# EAGLE design Conn_pcb3 (EAGLE 9.1.0)

## Sheet 1 of 2
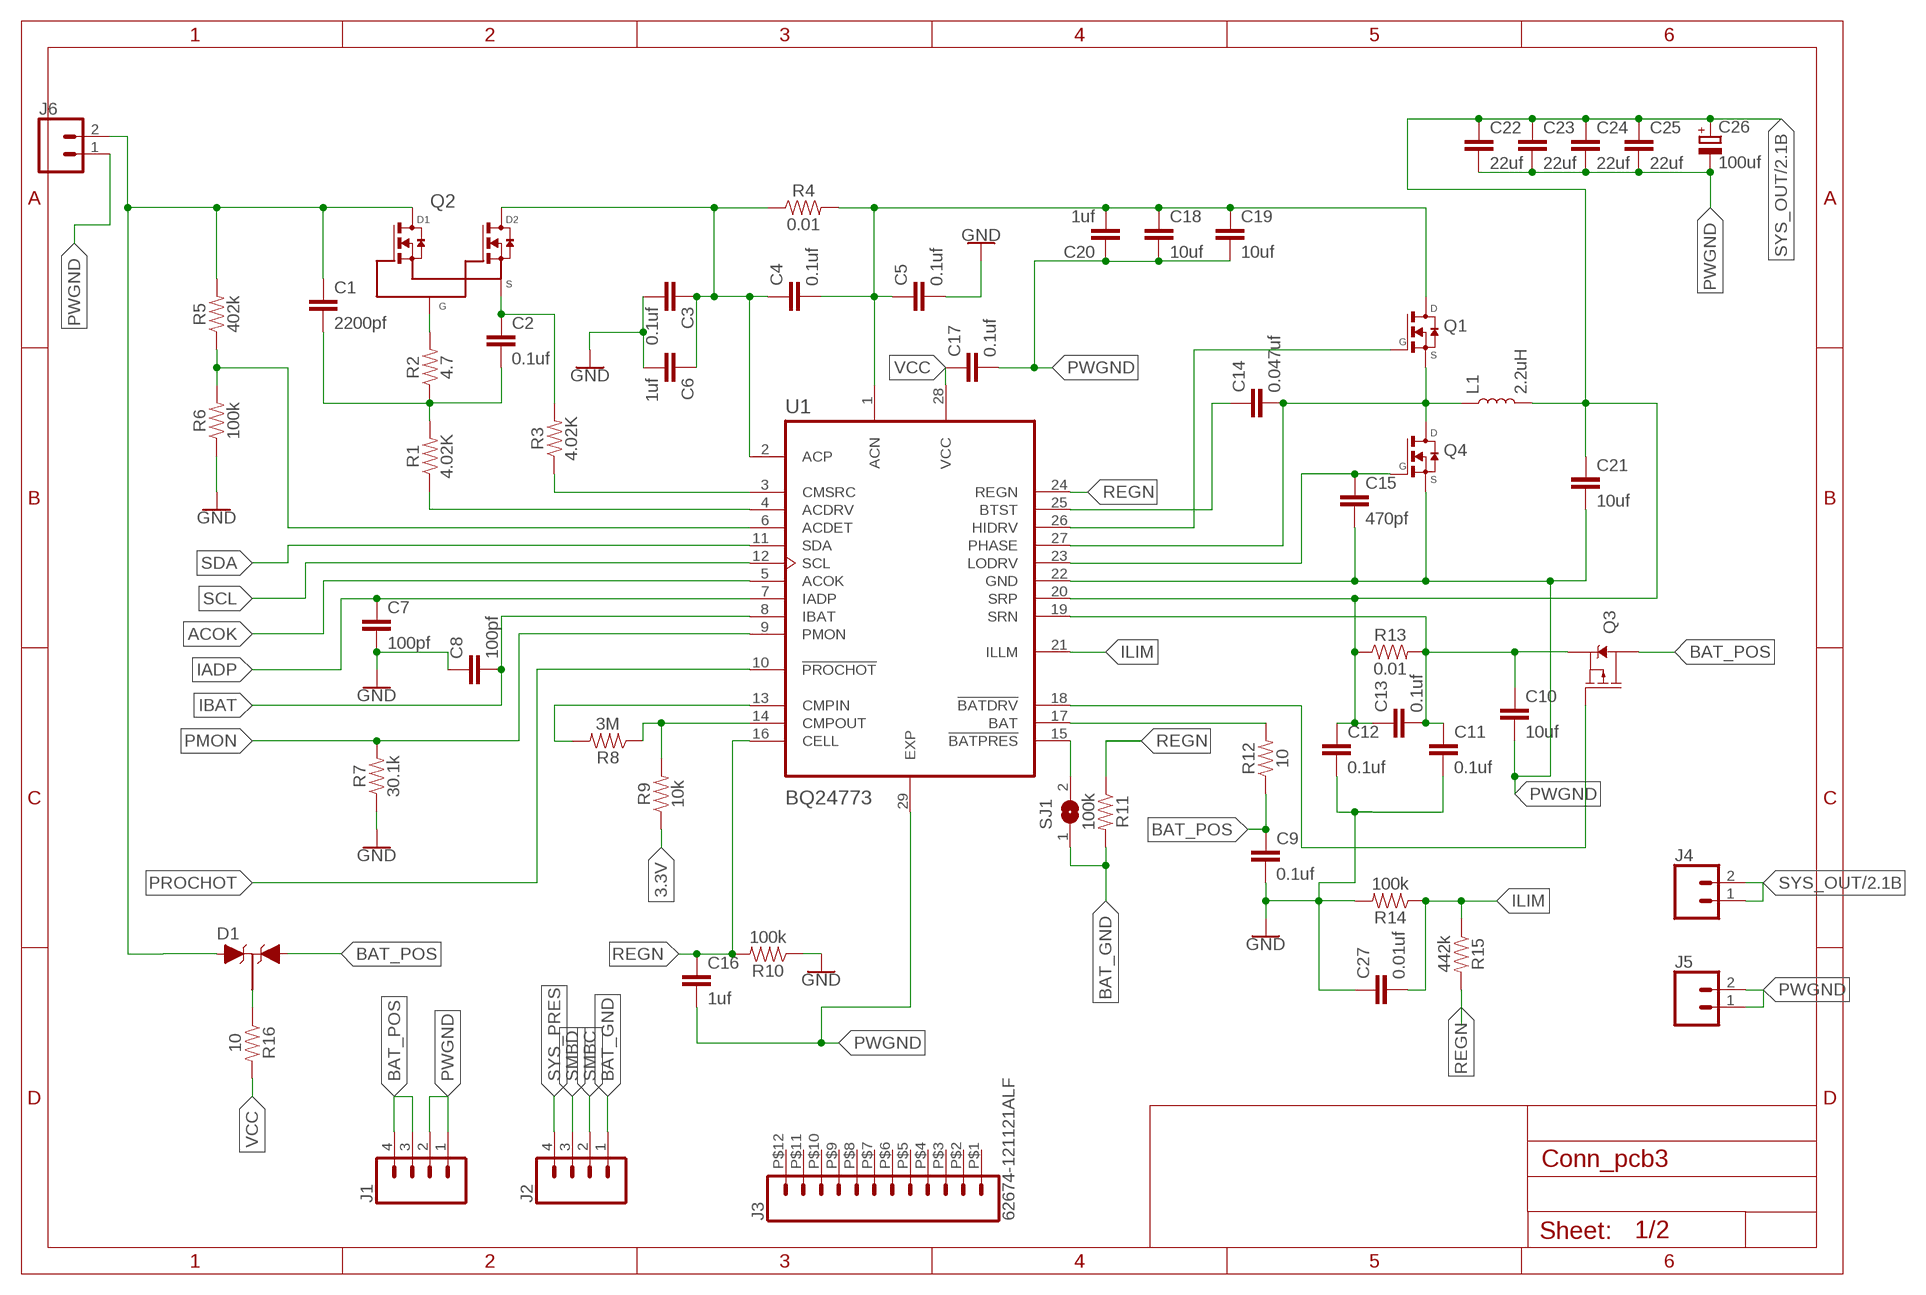
[diagram p0: schematic, sheet 1]

### Parts
C1  2200pf  CAP0402  [CAPC1005X50]
C2  0.1uf  CAP0402  [CAPC1005X50]
C3  0.1uf  CAP0402  [CAPC1005X50]
C4  0.1uf  CAP0402  [CAPC1005X50]
C5  0.1uf  CAP0402  [CAPC1005X50]
C6  1uf  CAP0402  [CAPC1005X50]
C7  100pf  CAP0402  [CAPC1005X50]
C8  100pf  CAP0402  [CAPC1005X50]
C9  0.1uf  CAP0402  [CAPC1005X50]
C10  10uf  C-EUC0805K  [C0805K]
C11  0.1uf  CAP0402  [CAPC1005X50]
C12  0.1uf  CAP0402  [CAPC1005X50]
C13  0.1uf  CAP0402  [CAPC1005X50]
C14  0.047uf  CAP0402  [CAPC1005X50]
C15  470pf  CAP0402  [CAPC1005X50]
C16  1uf  CAP0402  [CAPC1005X50]
C17  0.1uf  CAP0402  [CAPC1005X50]
C18  10uf  C-EUC0805K  [C0805K]
C19  10uf  C-EUC0805K  [C0805K]
C20  1uf  CAP0402  [CAPC1005X50]
C21  10uf  C-EUC0805K  [C0805K]
C22  22uf  C-EUC1206  [C1206]
C23  22uf  C-EUC1206  [C1206]
C24  22uf  C-EUC1206  [C1206]
C25  22uf  C-EUC1206  [C1206]
C26  100uf  16SVP100M  [CAPAE1030X800]
C27  0.01uf  CAP0402  [CAPC1005X50]
D1  BAT54C-7-F  [SOT95P235X110-3]
J1  CONN_041.3  [1X04_NO_SILK_1.3]
J2  CONN_041.3  [1X04_NO_SILK_1.3]
J3  62674-121121ALF  [62674-121121ALF]
J4  CONN_021.4HOLE  [1X02_1.4HOLE]
J5  CONN_021.4HOLE  [1X02_1.4HOLE]
J6  CONN_021.4HOLE  [1X02_1.4HOLE]
L1  2.2uH  XEL6060-222MEB  [RESM6365X610]
Q1  CSD17308Q3  [SON65P330X330X110-8]
Q2  CSD87312Q3EVSON  [QFN65P330X330X100-12]
Q3  CSD25402Q3A  [CSD25402Q3A]
Q4  CSD17308Q3  [SON65P330X330X110-8]
R1  4.02K  RES4K04020402  [0402]
R2  4.7  RES4K04020402  [0402]
R3  4.02K  RES4K04020402  [0402]
R4  0.01  SENSE-RES  [1206]
R5  402k  RES4K04020402  [0402]
R6  100k  RES4K04020402  [0402]
R7  30.1k  RES4K04020402  [0402]
R8  3M  RES4K04020402  [0402]
R9  10k  RES4K04020402  [0402]
R10  100k  RES4K04020402  [0402]
R11  100k  RES4K04020402  [0402]
R12  10  RES4K04020402  [0402]
R13  0.01  SENSE-RES  [1206]
R14  100k  RES4K04020402  [0402]
R15  442k  RES4K04020402  [0402]
R16  10  RES4K04020402  [0402]
SJ1  SJ  [SJ]
U1  BQ24773  [QFN40P400X400X80-29T240]

### Nets
3.3V: R9.1
ACOK: U1.5(ACOK)
BAT_GND: J2.1 R11.2 SJ1.1
BAT_POS: C9.1 D1.2(A2) J1.3 J1.4 Q3.1(D) Q3.2(D) Q3.3(D) R12.1
GND: C3.2 C5.2 C6.2 C7.2 C8.1 C9.2 C11.2 C12.2 C27.1 R6.1 R7.1 R10.1 R14.2
IADP: C7.1 U1.7(IADP)
IBAT: C8.2 U1.8(IBAT)
ILIM: C27.2 R14.1 R15.1 U1.21(ILLM)
N$1: R1.1 U1.4(ACDRV)
N$2: C1.2 C2.2 R1.2 R2.1
N$3: Q2.5(G) R2.2
N$4: C1.1 D1.1(A1) J6.2 Q2.1(D1) Q2.3(D1) Q2.4(D1) R5.2
N$5: R5.1 R6.2 U1.6(ACDET)
N$6: C4.2 C5.1 C18.1 C19.1 C20.2 Q1.5(D) Q1.6(D) Q1.7(D) Q1.8(D) R4.2 U1.1(ACN)
N$7: C2.1 Q2.9(S) Q2.9.1(S) Q2.9.2(S) Q2.9.3(S) Q2.9.4(S) R3.2
N$8: R3.1 U1.3(CMSRC)
N$9: C3.1 C4.1 C6.1 Q2.6(D2) Q2.7(D2) Q2.8(D2) R4.1 U1.2(ACP)
N$10: R8.2 U1.13(CMPIN)
N$11: R8.1 R9.2 U1.14(CMPOUT)
N$12: R12.2 U1.17(BAT)
N$13: Q3.4(G) U1.18(!BATDRV)
N$14: C10.1 C11.1 C13.2 Q3.5(S) Q3.6(S) Q3.7(S) Q3.8(S) Q3.9(S) R13.2 U1.19(SRN)
N$15: C15.1 Q4.4(G) U1.23(LODRV)
N$16: SJ1.2 U1.15(!BATPRES)
N$17: D1.3(K) R16.1
N$18: C14.2 L1.1 Q1.1(S) Q1.2(S) Q1.3(S) Q4.5(D) Q4.6(D) Q4.7(D) Q4.8(D) U1.27(PHASE)
N$19: C14.1 U1.25(BTST)
N$20: Q1.4(G) U1.26(HIDRV)
PMON: R7.2 U1.9(PMON)
PROCHOT: U1.10(!PROCHOT)
PWGND: C10.2 C15.2 C16.2 C17.2 C18.2 C19.2 C20.1 C21.2 C22.2 C23.2 C24.2 C25.2 C26.2(-) J1.1 J1.2 J5.1 J5.2 J6.1 Q4.1(S) Q4.2(S) Q4.3(S) U1.22(GND) U1.29(EXP)
REGN: C16.1 R10.2 R11.1 R15.2 U1.16(CELL) U1.24(REGN)
SCL: U1.12(SCL)
SDA: U1.11(SDA)
SMBC: J2.2
SMBD: J2.3
SYS_OUT: C12.1 C13.1 C21.1 C22.1 C23.1 C24.1 C25.1 C26.1(+) J4.1 J4.2 L1.2 R13.1 U1.20(SRP) ; also sheet 2
SYS_PRES: J2.4
VCC: C17.1 R16.2 U1.28(VCC)
Unconnected: J3.P$1 J3.P$2 J3.P$3 J3.P$4 J3.P$5 J3.P$6 J3.P$7 J3.P$8 J3.P$9 J3.P$10 J3.P$11 J3.P$12

## Sheet 2 of 2
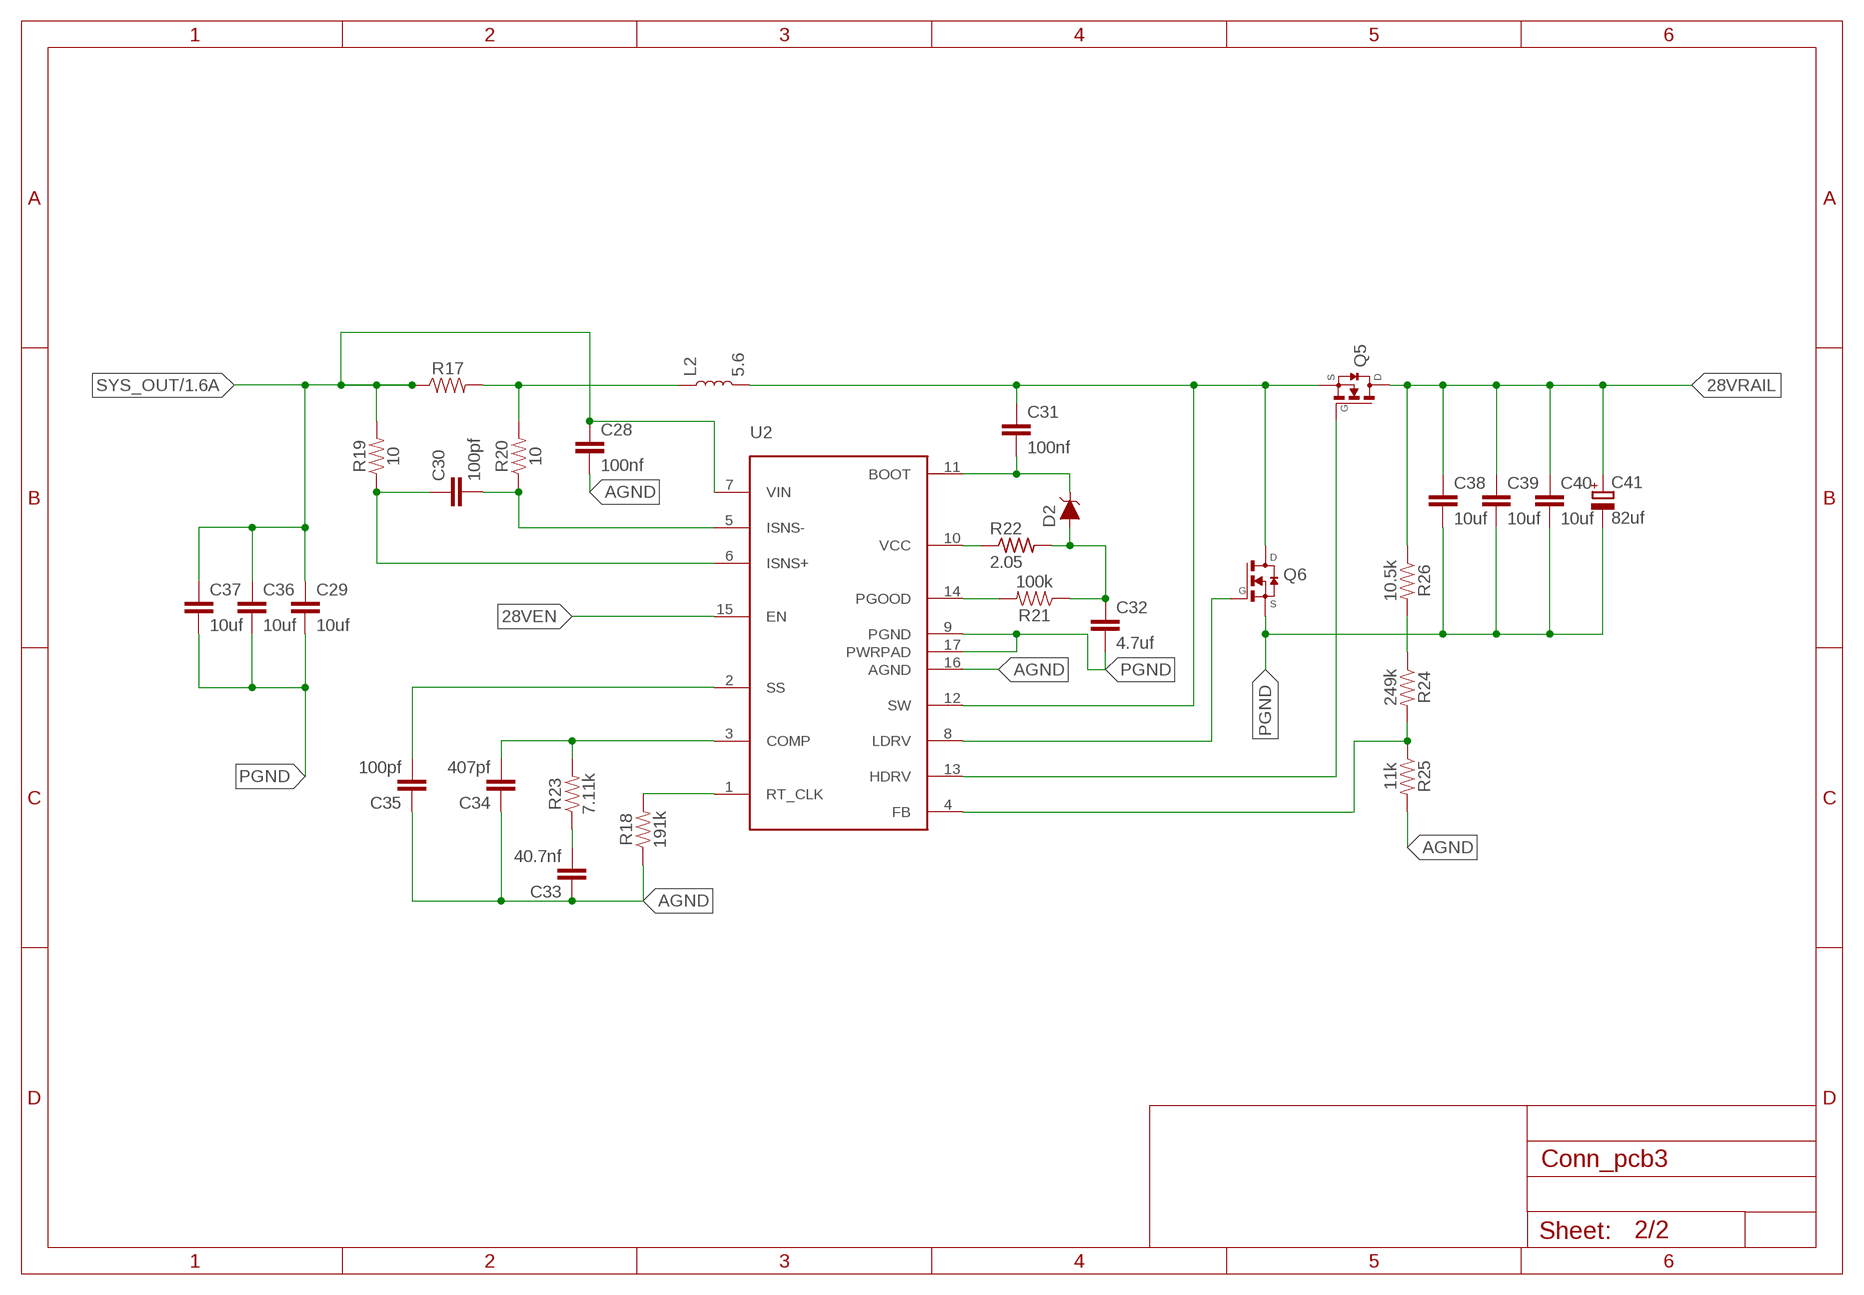
[diagram p1: schematic, sheet 2]

### Parts
C28  100nf  C-EUC0402K  [C0402K]
C29  10uf  C-EUC0805K  [C0805K]
C30  100pf  C-EUC0402K  [C0402K]
C31  100nf  C-EUC0402K  [C0402K]
C32  4.7uf  C-EUC0402K  [C0402K]
C33  40.7nf  C-EUC0402K  [C0402K]
C34  407pf  C-EUC0402K  [C0402K]
C35  100pf  C-EUC0402K  [C0402K]
C36  10uf  C-EUC0805K  [C0805K]
C37  10uf  C-EUC0805K  [C0805K]
C38  10uf  C-EUC0805K  [C0805K]
C39  10uf  C-EUC0805K  [C0805K]
C40  10uf  C-EUC0805K  [C0805K]
C41  82uf  PCR1H820MCL6GS  [CAPAE830X1040]
D2  SS24FL  [SODFL3617X108]
L2  5.6  XAL7070-472MEB  [RESM7275X700]
Q5  SIS184DN-T1-GE3  [SIS184DN-T1-GE3]
Q6  SIS184DN-T1-GE3  [SIS184DN-T1-GE3]
R17  LRMAM2512-R0035FT4  [RESC6432X90]
R18  191k  RES4K04020402  [0402]
R19  10  RES4K04020402  [0402]
R20  10  RES4K04020402  [0402]
R21  100k  RES4K04020402  [0402]
R22  2.05  R-US_R0603  [R0603]
R23  7.11k  RES4K04020402  [0402]
R24  249k  RES4K04020402  [0402]
R25  11k  RES4K04020402  [0402]
R26  10.5k  RES4K04020402  [0402]
U2  TPS43061  [QFN50P300X300X100-17T80X120]

### Nets
28VEN: U2.15(EN)
28VRAIL: C38.1 C39.1 C40.1 C41.1(+) Q5.P$5(D) Q5.P$6(D) Q5.P$7(D) Q5.P$8(D) Q5.P$9(D) R26.1
AGND: C28.2 C33.1 C34.1 C35.1 R18.1 R25.2 U2.16(AGND)
N$21: C31.1 L2.2 Q5.P$1(S) Q5.P$2(S) Q5.P$3(S) Q6.P$5(D) Q6.P$6(D) Q6.P$7(D) Q6.P$8(D) Q6.P$9(D) U2.12(SW)
N$22: R24.1 R26.2
N$23: L2.1 R17.2 R20.2
N$24: C30.1 R19.1 U2.6(ISNS+)
N$26: C30.2 R20.1 U2.5(ISNS-)
N$27: C31.2 D2.1(C) U2.11(BOOT)
N$28: C32.1 D2.2(A) R21.1 R22.2
N$29: R21.2 U2.14(PGOOD)
N$30: R22.1 U2.10(VCC)
N$31: R18.2 U2.1(RT_CLK)
N$32: Q5.P$4(G) U2.13(HDRV)
N$33: Q6.P$4(G) U2.8(LDRV)
N$34: R24.2 R25.1 U2.4(FB)
N$35: C34.2 R23.2 U2.3(COMP)
N$36: C33.2 R23.1
N$38: C35.2 U2.2(SS)
PGND: C29.2 C32.2 C36.2 C37.2 C38.2 C39.2 C40.2 C41.2(-) Q6.P$1(S) Q6.P$2(S) Q6.P$3(S) U2.9(PGND) U2.17(PWRPAD)
SYS_OUT: C28.1 C29.1 C36.1 C37.1 R17.1 R19.2 U2.7(VIN) ; also sheet 1

## Library data of the parts
C1-C9 C11-C17 C20 C27 = BMS:CAP0402
C10 C18 C19 C21-C25 C28-C40 = rcl:C-EU: CAPACITOR, European symbol; SPICEPREFIX: C
C26 = BMS:16SVP100M
C41 = BMS:PCR1H820MCL6GS
D1 = BMS:BAT54C-7-F
D2 = BMS:SS24FL
J1 J2 = SparkFun-Connectors:CONN_04: Multi connection point. Often used as Generic Header-pin footprint for 0.1 inch spaced/style header connections On any of the 0.1 inch spaced packages, you can populate with these: Break Away Headers - Straight <https://www.sparkfun.com/products/116> (PRT-00116) Break Away Male Headers - Right Angle <https://www.sparkfun.com/products/553> (PRT-00553) Female Headers <https://www.sparkfun.com/products/115> (PRT-00115) Break Away Headers - Machine Pin <https://www.sparkfun.com/products/117> (PRT-00117) Break Away Female Headers - Swiss Machine Pin <https://www.sparkfun.com/products/743> (PRT-00743) For SCREWTERMINALS and SPRING TERMINALS visit here: Screw Terimnals on SparkFun.com <https://www.sparkfun.com/search/results?term=Screw+Terminals> (5mm/3.5mm/2.54mm spacing) This device is also useful as a general connection point to wire up your design to another part of your project. Our various solder wires solder well into these plated through hole pads. Hook-Up Wire - Assortment (Stranded, 22 AWG) <https://www.sparkfun.com/products/11375> (PRT-11375) Hook-Up Wire - Assortment (Solid Core, 22 AWG) <https://www.sparkfun.com/products/11367> (PRT-11367) View the entire wire category on our website here <https://www.sparkfun.com/categories/141> Special notes: Molex polarized connector foot print use with SKU : PRT-08231 with associated crimp pins and housings. 1MM SMD Version SKU: PRT-10208
J3 = CSD25402Q3A:62674-121121ALF
J4-J6 = SparkFun-Connectors:CONN_02: Multi connection point. Often used as Generic Header-pin footprint for 0.1 inch spaced/style header connections On any of the 0.1 inch spaced packages, you can populate with these: Break Away Headers - Straight <https://www.sparkfun.com/products/116> (PRT-00116) Break Away Male Headers - Right Angle <https://www.sparkfun.com/products/553> (PRT-00553) Female Headers <https://www.sparkfun.com/products/115> (PRT-00115) Break Away Headers - Machine Pin <https://www.sparkfun.com/products/117> (PRT-00117) Break Away Female Headers - Swiss Machine Pin <https://www.sparkfun.com/products/743> (PRT-00743) For SCREWTERMINALS and SPRING TERMINALS visit here: Screw Terimnals on SparkFun.com <https://www.sparkfun.com/search/results?term=Screw+Terminals> (5mm/3.5mm/2.54mm spacing) This device is also useful as a general connection point to wire up your design to another part of your project. Our various solder wires solder well into these plated through hole pads. Hook-Up Wire - Assortment (Stranded, 22 AWG) <https://www.sparkfun.com/products/11375> (PRT-11375) Hook-Up Wire - Assortment (Solid Core, 22 AWG) <https://www.sparkfun.com/products/11367> (PRT-11367) View the entire wire category on our website here <https://www.sparkfun.com/categories/141> Special notes: Molex polarized connector foot print use with: PRT-08233 with associated crimp pins and housings. 2.54_SCREWTERM for use with PRT-10571. 3.5mm Screw Terminal footprints for PRT-08084 5mm Screw Terminal footprints for use with PRT-08432
L1 = BMS:XEL6060-222MEB
L2 = BMS:XAL7070-472MEB
Q1 Q4 = BMS:CSD17308Q3; SPICEPREFIX: Q
Q2 = BMS:CSD87312Q3E
Q3 = CSD25402Q3A:CSD25402Q3A; MANUFACTURER_PART_NUMBER: CSD25402Q3A; VENDOR: Texas Instruments
Q5 Q6 = CSD25402Q3A:SIS184DN-T1-GE3
R1-R3 R5-R12 R14-R16 R18-R21 R23-R26 = BMS:RES4K0402
R4 R13 = BMS:SENSE-RES
R17 = BMS:LRMAM2512-R0035FT4
R22 = rcl:R-US_: RESISTOR, American symbol; SPICEPREFIX: R
SJ1 = jumper:SJ: SMD solder JUMPER
U1 = BMS:BQ24773
U2 = BMS:TPS43061

## Board
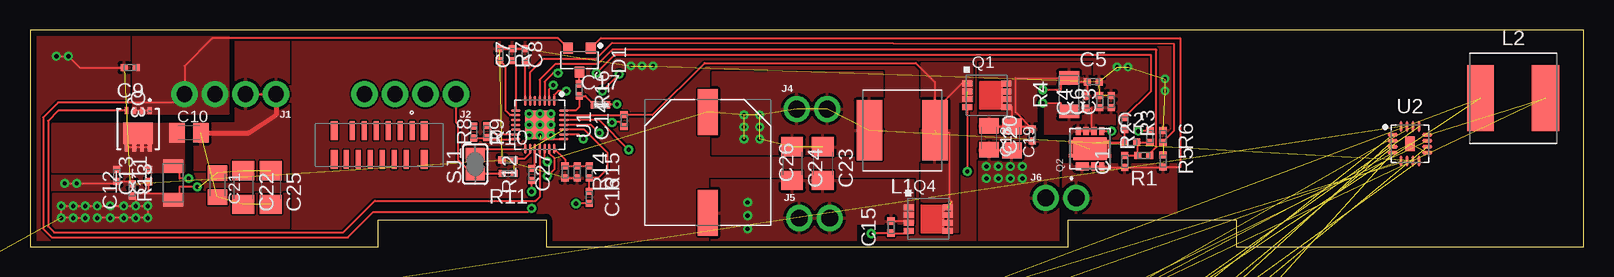
[diagram p2: board, top side]
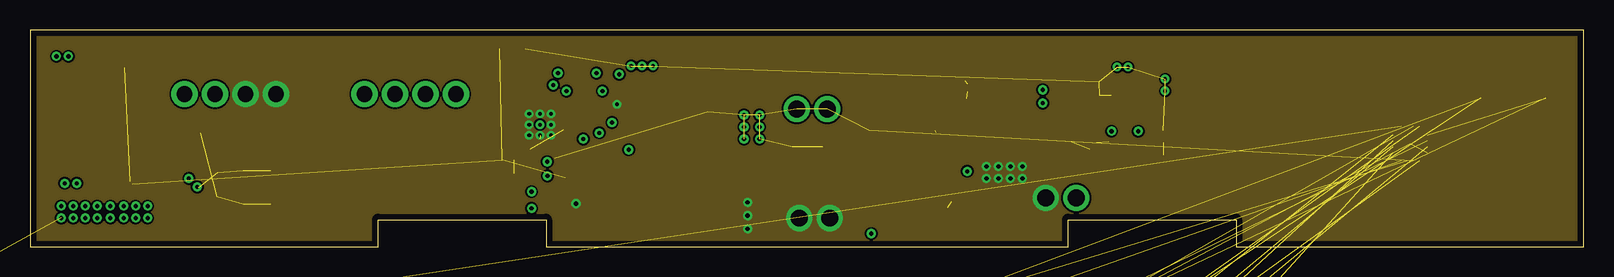
[diagram p3: board, inner layer Route2]
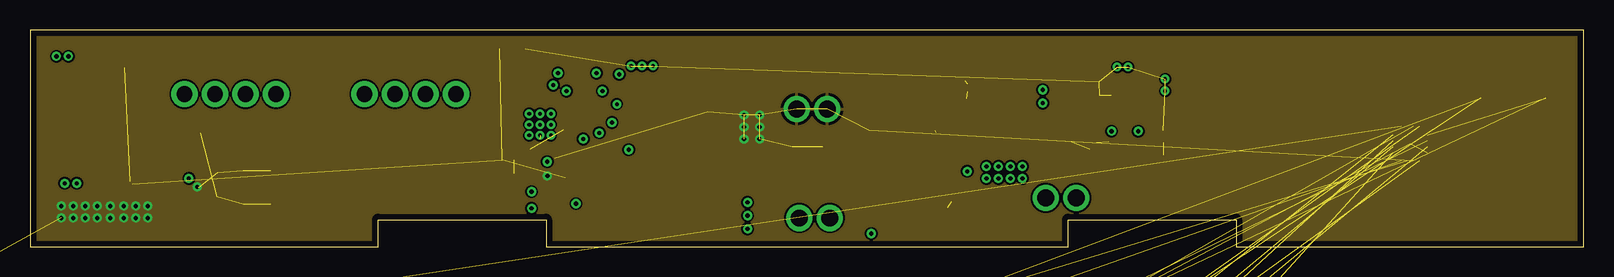
[diagram p4: board, inner layer Route15]
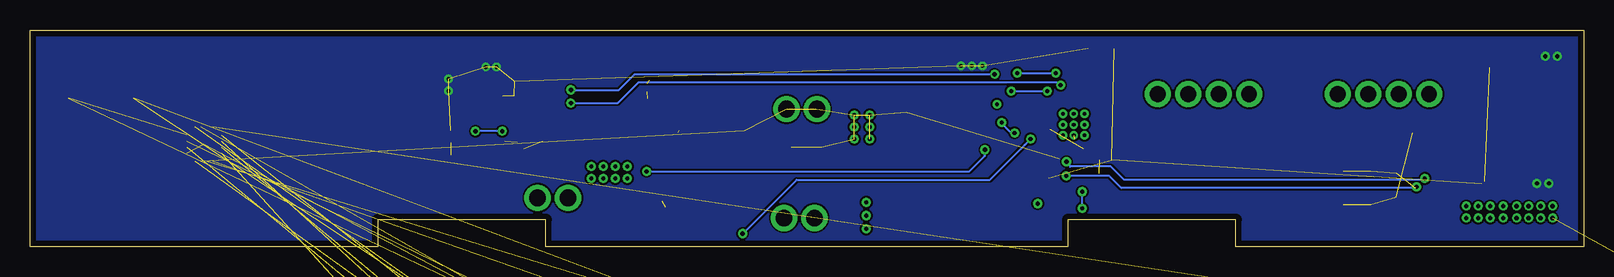
[diagram p5: board, bottom side, seen from below]

Size 129.48 x 18.1 mm. Coordinates in mm from the lower left corner, seen from the top.
Outline: 0,0 29,0 29,2.25 43,2.25 43,0 86.5,0 86.5,2.25 100.5,2.25 100.5,0 129.48,0 129.48,18.1 0,18.1 0,0
Copper layers (1+2*15+16): Top 0.07mm / dielectric 0.15mm / Route2 0.07mm / dielectric 0.3mm / Route15 0.07mm / dielectric 0.15mm / Bottom 0.07mm
Design rules "default *": minimum track width 6mil, minimum drill 0.3mm, track to track 6mil, track to pad 6mil, pad to pad 6mil, via to via 6mil, smd to smd 6mil, copper to edge 20mil, drill to drill 6mil, minimum pad ring 10mil, minimum via ring 8mil, stop-mask expansion 0.07mm, vias tented up to drill 0mil, thermal gap 10mil

### Footprints (pad centres in the part's own frame; a part is rotated, then mirrored left to right if it is on the bottom)
CAPC1005X50 = smd 0.6 x 0.6: 1 -0.5,0; 2 0.5,0
C0805K = smd 1.3 x 1.6: 1 -1,0; 2 1,0
C1206 = smd 1.6 x 1.8: 1 -1.4,0; 2 1.4,0
CAPAE1030X800 = smd 3.815 x 1.629: 1 -4.2,0; 2 4.2,0
C0402K = smd 0.925 x 0.74: 1 -0.6,0; 2 0.6,0
CAPAE830X1040 = smd 3.714 x 2.12: 1 -3.451,0; 2 3.451,0
SOT95P235X110-3 = smd 0.9 x 0.8: 1 -1,0.95; 2 -1,-0.95; 3 1,0
SODFL3617X108 = smd 1.34 x 1.8: 1 -1.43,0; 2 1.43,0
1X04_NO_SILK_1.3 = drill 1.3 pad 2.184: 1 0,0; 2 2.54,0; 3 5.08,0; 4 7.62,0
62674-121121ALF = smd 0.4 x 1.6: P$1 2.75,1.2; P$2 2.25,-1.2; P$3 1.75,1.2; P$4 1.25,-1.2; P$5 0.75,1.2; P$6 0.25,-1.2; P$7 -0.25,1.2; P$8 -0.75,-1.2; P$9 -1.25,1.2; P$10 -1.75,-1.2; P$11 -2.25,1.2; P$12 -2.75,-1.2 | smd 0.6 x 1.6: P$13 -3.75,1.2; P$14 -3.75,-1.2; P$15 3.75,1.2; P$16 3.75,-1.2
1X02_1.4HOLE = drill 1.4 pad 2.184: 1 0,0; 2 2.54,0
RESM6365X610 = smd 2.115 x 5.012: 1 -2.73,0; 2 2.73,0
RESM7275X700 = smd 2.217 x 5.5: 1 -2.71,0 | smd 2.296 x 5.5: 2 2.71,0
SON65P330X330X110-8 = smd 0.5 x 0.83: 1 -0.975,-1.635; 2 -0.325,-1.635; 3 0.325,-1.635; 4 0.975,-1.635; 5 0.975,1.635; 6 0.325,1.635; 7 -0.325,1.635; 8 -0.975,1.635
QFN65P330X330X100-12 = smd 0.65 x 1.09: 1 -1.475,0.65 | smd 0.65 x 0.44: 3 -1.475,-0.325; 4 -1.475,-0.975; 5 1.475,-0.975; 6 1.475,-0.325; 7 1.475,0.325; 8 1.475,0.975 | smd 1.9 x 2.8: 9 0,0 | smd 0.3 x 0.35: 9.1 -0.59,1.575; 9.2 0.59,1.575; 9.3 -0.59,-1.575; 9.4 0.59,-1.575
CSD25402Q3A = smd 0.61 x 0.305: 1 -1.549,0.975; 2 -1.549,0.325; 3 -1.549,-0.325; 4 -1.549,-0.975; 5 1.549,-0.975; 6 1.549,-0.325; 7 1.549,0.325; 8 1.549,0.975 | smd 1.778 x 2.438: 9 0.356,0
SIS184DN-T1-GE3 = smd 0.99 x 0.405: P$1 -1.435,0.99; P$2 -1.435,0.33; P$3 -1.435,-0.33; P$4 -1.435,-0.99 | smd 0.76 x 0.405: P$5 1.55,-0.99; P$6 1.55,-0.33; P$7 1.55,0.33; P$8 1.55,0.99 | smd 1.725 x 2.235: P$9 0.557,0
0402 = smd 0.6 x 0.6: 1 -0.5,0; 2 0.5,0
1206 = smd 1.131 x 1.67: 1 -1.395,0; 2 1.395,0
RESC6432X90 = smd 2.1 x 4: 1 -3.1,0; 2 3.1,0
R0603 = smd 1 x 1.1: 1 -0.85,0; 2 0.85,0
SJ = smd 1.168 x 1.6: 1 -0.762,0; 2 0.762,0
QFN40P400X400X80-29T240 = smd 0.8 x 0.2: 1 -2,1.2; 2 -2,0.8; 3 -1.999,0.398; 4 -1.997,0; 5 -2,-0.4; 6 -2,-0.8; 7 -2,-1.2; 15 2,-1.2; 16 2,-0.8; 17 2,-0.4; 18 2,0; 19 2,0.4; 20 2,0.8; 21 2,1.2 | smd 0.2 x 0.8: 8 -1.2,-2; 9 -0.8,-2; 10 -0.4,-2; 11 0,-2; 12 0.4,-2; 13 0.8,-2; 14 1.2,-2; 22 1.2,2; 23 0.8,2; 24 0.4,2; 25 0,2; 26 -0.4,2; 27 -0.8,2; 28 -1.2,2 | smd 2.4 x 2.4: 29 0,0
QFN50P300X300X100-17T80X120 = smd 0.896 x 0.264: 1 -1.437,0.75; 2 -1.437,0.25; 3 -1.437,-0.25; 4 -1.437,-0.75; 9 1.437,-0.75; 10 1.437,-0.25; 11 1.437,0.25; 12 1.437,0.75 | smd 0.264 x 0.896: 5 -0.75,-1.437; 6 -0.25,-1.437; 7 0.25,-1.437; 8 0.75,-1.437; 13 0.75,1.437; 14 0.25,1.437; 15 -0.25,1.437; 16 -0.75,1.437 | smd 0.8 x 1.2: 17 0,0

### Placement (x,y rotation side)
C1  91.23,7.13 90 top
C2  91.74,8.72 0 top
C3  90.1,12.12 90 top
C4  88.03,12.08 90 top
C5  88.6,13.77 0 top
C6  89.13,12.12 90 top
C7  41.28,16.04 90 top
C8  40.2,16.05 270 top
C9  8.36,14.96 180 top
C10  13.24,9.51 0 top
C11  7.23,5.96 270 top
C12  8.52,4.74 90 top
C13  9.87,5.94 90 top
C14  49.5,10.54 90 top
C15  71.75,1.64 90 top
C16  46.6,4.13 270 top
C17  47.54,11.85 0 top
C18  79.92,9.09 270 top
C19  81.83,9.04 270 top
C20  83.53,9.34 90 top
C21  15.62,5.15 270 top
C22  17.77,4.95 270 top
C23  66.06,6.95 270 top
C24  63.51,6.95 270 top
C25  20.06,4.95 270 top
C26  56.48,7.04 270 top
C27  44.59,6.25 90 top
C28  -19.4,-10.1 0 top  (outside the outline)
C29  -1,-52.5 0 top  (outside the outline)
C30  -19.4,-56.8 0 top  (outside the outline)
C31  -27.3,-60.7 0 top  (outside the outline)
C32  -35.8,-103.6 0 top  (outside the outline)
C33  -35.8,-119.7 0 top  (outside the outline)
C34  -35.8,-123.6 0 top  (outside the outline)
C35  -35.8,-127.5 0 top  (outside the outline)
C36  -35.7,-131.8 0 top  (outside the outline)
C37  -35.7,-136.6 0 top  (outside the outline)
C38  -35.7,-141.4 0 top  (outside the outline)
C39  -35.7,-146.2 0 top  (outside the outline)
C40  -35.7,-151 0 top  (outside the outline)
C41  -3.45,-186 0 top  (outside the outline)
D1  45.78,15.57 270 top
D2  -24.6,-66.1 0 top  (outside the outline)
J1  20.5,12.75 180 top
J2  35.5,12.75 180 top
J3  29.1,8.5 0 top
J4  63.9,11.5 0 top
J5  64.1,2.4 0 top
J6  84.64,4.09 0 top
L1  72.68,9.72 180 top
L2  123.6,12.4 0 top
Q1  79.72,12.64 270 top
Q2  88.33,8.18 90 top
Q3  9.01,9.82 270 top
Q4  74.85,2.32 270 top
Q5  -33.6,-95.5 0 top  (outside the outline)
Q6  -33.6,-100.4 0 top  (outside the outline)
R1  92.82,7.63 180 top
R2  93.33,9.21 90 top
R3  91.22,10.31 270 top
R4  86.59,12.7 90 top
R5  94.42,7.16 270 top
R6  94.42,9.21 270 top
R7  39.13,16.03 270 top
R8  38.06,9.61 90 top
R9  36.99,9.59 270 top
R10  39.84,7.24 0 top
R11  39.86,6.11 180 top
R12  41.81,6.04 90 top
R13  11.94,5.34 90 top
R14  45.6,6.25 270 top
R15  46.61,6.25 270 top
R16  45.76,13.1 270 top
R17  -32.8,-87.4 0 top  (outside the outline)
R18  -34.9,-108.7 0 top  (outside the outline)
R19  -18.5,-33.7 0 top  (outside the outline)
R20  -18.5,-39.8 0 top  (outside the outline)
R21  -26,-70.6 0 top  (outside the outline)
R22  -0.85,-89.4 0 top  (outside the outline)
R23  -34.9,-114.8 0 top  (outside the outline)
R24  -35,-156.5 0 top  (outside the outline)
R25  -35,-162.6 0 top  (outside the outline)
R26  -35,-195.7 0 top  (outside the outline)
SJ1  37.1,6.9 90 top
U1  42.48,10.18 270 top
U2  115,8.6 0 top

### Tracks (layer width: path | path; a pad name or v marks a point on that pad's centre or on a via)
28VRAIL  (9 unrouted)
AGND  (6 unrouted)
BAT_GND
  Top 0.152: 36.6,6.14 SJ1.1 | R11.2 37.1,6.11 SJ1.1 | SJ1.1 36.8,6.14 35.7,7.24 35.7,10.2 35.5,10.4 J2.1
BAT_POS  (via drill 0.35)
  Top 0.152: Q3.1 Q3.2 Q3.3 | D1.2 44,17.4 15.2,17.4 12.88,15.08 J1.4 12.18,12.05 2.35,12.05 1.1,10.8 1.1,1.5 1.82,0.78 26.48,0.78 28.6,2.9 41.5,2.9 v41.8,3.2 | v41.8,4.6 R12.1
  Bottom 0.152: v41.8,3.2 v41.8,4.6
  pour Top (no thermals): 8.6,19.8 16.5,19.8 16.5,11.1 8.6,11.1
GND  (via drill 0.3, 0.35)  (15 unrouted)
  Top 0.152: R7.1 40.18,16.53 C8.1 C7.2 | v2.9,5.3 v3.9,5.3 7.07,5.3 C11.2 8.3,5.46 C12.2 | v2.2,15.9 v3.2,15.9 4.14,14.96 C9.2 | C27.1 R14.2
  other vias: 51.9,15.1 91.5,15 90.6,15 94.6,14 94.6,13 51,15.1 50.1,15.1
  pour Top (rank 6): -7.1,22.2 -7.1,-8.1 138.3,-8.1 138.3,22.2
  pour Bottom: -9.4,28.5 -9.4,-1.5 134,-1.5 134,28.5
IADP
  Top 0.152: U1.7 C7.1
IBAT
  Top 0.152: U1.8 40.48,15.27 C8.2
ILIM
  Top 0.152: U1.21 44.59,7.27 C27.2 R14.1 R15.1
N$1
  Top 0.152: R1.1 93.32,7.78 93.86,8.31 93.86,16.45 48.5,16.45 47.3,15.25 43.78,15.25 42.47,13.94 U1.4
N$2
  Top 0.152: C1.2 R1.2 92.32,8.64 C2.2 R2.1
N$3  (via drill 0.35)
  Top 0.152: Q2.5 90.08,9.65 v90.13,9.65 | v92.36,9.65 92.42,9.71 R2.2
  Bottom 0.152: v90.13,9.65 v92.36,9.65
N$4
  Top 0.152: Q2.1 Q2.3 Q2.4 89.38,6.63 C1.1 94.3,6.63 | 94.3,6.63 94.39,6.63 R5.2 | D1.1 47.58,17.42 95.85,17.42 95.85,6.63 94.3,6.63
  pour Top: 86.1,6.9 95.5,6.9 95.5,-0.4 86.1,-0.4
N$5  (1 unrouted)
  Top 0.152: R6.2 94.42,8.79 95.35,9.71 95.35,16.94 48.52,17.02 47.2,15.7 42.8,15.7 41.68,14.58 U1.6
N$6  (via drill 0.35)
  Top 0.152: R4.2 86.59,13.77 C5.1 88.1,12.58 C4.2 | C19.1 79.97,10.04 C18.1 | C19.1 83.53,10.04 C20.2 82.13,11.24 82.13,14.1 R4.2 | Q1.5 81.83,11.66 C19.1 | v44.7,13 44,13 43.68,12.68 U1.1 | v49.1,14.4 v47.7,13 | R4.2 86.29,14.1 85.89,13.69 85.89,13.3 85.89,13.1 v84.4,13.1
  Bottom 0.152: v47.7,13 v44.7,13 | v84.4,13.1 80.4,13.1 79.1,14.4 v49.1,14.4
  pour Top: 79.1,15.3 79.1,9.6 83.9,9.6 83.9,13.6 87.8,13.6 87.8,12.3 88.4,12.3 88.4,15.3
N$7  (2 unrouted)
  Top 0.152: Q2.9.3 Q2.9.4 | Q2.9.2 Q2.9.1 | Q2.9 88.87,8.72 C2.1 91.24,9.79 R3.2
N$8  (via drill 0.35)
  Top 0.152: v47.2,14.5 48.7,16 93.42,16 93.42,13.01 R3.1 | U1.3 42.88,13.78 43.6,14.5 v44,14.5
  Bottom 0.152: v47.2,14.5 v44,14.5
N$9  (via drill 0.35)
  Top 0.152: Q2.8 Q2.7 Q2.6 88.66,9.76 88.45,9.96 88.45,11.58 C4.1 88.03,11.31 R4.1 86.09,11.31 85.89,11.51 85.89,12 v84.4,12 | U1.2 43.28,13.18 v43.6,13.5
  Bottom 0.152: v84.4,12 80.51,12 78.81,13.7 43.9,13.7 43.7,13.5 v43.6,13.5
  pour Top: 88.8,9.4 84.6,9.4 84.6,11.8 88.8,11.8 90.4,11.8 90.4,10.2 88.8,10.2
N$10
  Top 0.152: U1.13 38.79,9.38 R8.2
N$11
  Top 0.152: U1.14 38.2,8.97 R8.1 38.04,9.09 R9.2
N$12
  Top 0.152: R12.2 42.08,6.81 U1.17
N$13
  Top 0.152: Q3.4 2.37,11.37 1.5,10.5 1.5,1.7 2,1.2 26.1,1.2 28.74,3.84 42.14,3.84 42.5,4.2 42.5,8.16 U1.18
N$14  (via drill 0.35)
  Top 0.152: Q3.8 Q3.7 Q3.6 Q3.5 | v43.11,7.1 42.88,7.33 U1.19 | v13.24,5.7 12.44,5.7 12.44,6.43 12.14,6.73 R13.2
  Bottom 0.152: 37.4,5.6 13.34,5.6 v13.24,5.7 | 37.4,5.6 37.6,5.6 | v43.11,7.1 43.11,7.01 42.8,6.7 39.4,6.7 38.3,5.6 37.4,5.6
  pour Top (no thermals): 1.9,10.3 12.8,10.3 12.8,6.2 1.9,6.2
N$15  (via drill 0.35)
  Top 0.152: v70.1,1.1 70.1,1.14 C15.1 73.22,1.14 Q4.4 | v46.1,9 45.72,9.38 U1.23
  Bottom 0.152: v46.1,9 46.6,8.5 49.5,5.6 65.6,5.6 v70.1,1.1
N$16
  Top 0.152: U1.15 37.62,8.18 SJ1.2
N$17
  Top 0.152: R16.1 45.78,13.62 D1.3
N$18  (4 unrouted)
  Top 0.152: Q4.5 Q4.6 Q4.7 76.79,2.65 76.79,3.79 76.61,3.98 76.61,9.52 75.49,9.52 75.49,11.47 77.89,13.87 77.89,12.37 78.03,12.37 Q1.3 | U1.27 49.44,10.98 C14.2 49.56,10.98 51.86,10.98 56.22,15.34 73.83,15.34 75.41,13.76 L1.1
  pour Top: 74.3,15.32 78.5,15.32 78.5,12.1 77.3,12.1 77.3,1.2 74.3,1.2
N$19  (via drill 0.35)
  Top 0.152: C14.1 49.14,10.4 48.5,10.4 v48.5,10.37 | v47.44,9.51 46.76,10.18 U1.25
  Bottom 0.152: v48.5,10.37 48.5,10.3 47.7,9.5 47.69,9.51 v47.44,9.51
N$20  (via drill 0.35)
  Top 0.152: v49.9,8.1 47.42,10.58 U1.26 | Q1.4 78.08,6.32 v78.1,6.3
  Bottom 0.152: v78.1,6.3 51.2,6.3 49.9,7.6 v49.9,8.1
N$21  (10 unrouted)
N$22  (1 unrouted)
N$23  (2 unrouted)
N$24  (2 unrouted)
N$25  (via drill 0.3)
  other vias: 42.5,10.2
N$26  (2 unrouted)
N$27  (2 unrouted)
N$28  (3 unrouted)
N$29  (1 unrouted)
N$30  (1 unrouted)
N$31  (1 unrouted)
N$32  (1 unrouted)
N$33  (1 unrouted)
N$34  (2 unrouted)
N$35  (2 unrouted)
N$36  (1 unrouted)
N$38  (1 unrouted)
PGND  (12 unrouted)
PMON
  Top 0.152: U1.9 40.02,10.98 39.63,11.37 39.63,15.03 R7.2
PWGND  (via drill 0.3, 0.35)  (4 unrouted)
  Top 0.152: C15.2 73.22,2.14 Q4.3 | C18.2 81.83,8.09 C19.2 | J1.2 J1.1 | U1.29 42.48,8.98 U1.22 | C17.2 48.04,11.9 v48.9,11.9 | C16.2 45.53,3.63 v45.5,3.6
  Top 0.406: C10.2 18.21,9.51 20.5,11.01 J1.1
  other vias: 41.6,11.1 41.6,10.2 42.5,11.1 43.4,11.1 43.4,10.2 41.6,9.3 42.5,9.3 43.4,9.3 79.7,6.7 80.7,6.7 81.7,6.7 82.7,6.7 80.7,5.7 79.7,5.7 81.7,5.7 82.7,5.7 59.8,1.5 59.8,3.7 59.8,2.6
  pour Route2 (no thermals): -8.6,24 135.8,24 135.8,-6.2 -8.6,-6.2
  pour Top: 56.8,5.6 73.6,5.6 73.6,1.9 68.8,1.9 68.8,-0.5 56.8,-0.5 56.8,-0.2 56.8,1.8 56.8,2.2
  pour Top: 17.1,19.8 17.1,10.3 13.7,10.3 13.7,6.4 13.9,6.4 14.9,6.4 14.9,5.6 21.6,5.6 21.6,19.8
  pour Top: 79.1,8.8 85.7,8.8 85.7,-0.4 79.1,-0.4
REGN  (2 unrouted)
  Top 0.152: U1.24 44.51,9.81 46.16,9.81 48.09,7.88 48.09,6.5 47.34,5.75 R15.2 C16.1 | U1.16 41.68,7.81 41.22,7.35 40.45,7.35 R10.2
SYS_OUT  (via drill 0.35)  (22 unrouted)
  Top 0.152: 9.9,4.45 8.73,4.45 C12.1 8.8,3.96 v8.8,3.4 | 9.9,4.45 11.44,4.45 R13.1 12.44,4.45 12.44,5 v13.94,5 | U1.20 43.28,7.79 43.71,7.35 43.71,6.5 v43.12,5.91 | C13.1 9.87,4.48 9.9,4.45 | v4.6,2.4 v3.6,2.4 v2.6,2.4 v2.6,3.4 v3.6,3.4 v4.6,3.4 v5.6,3.4 v6.7,3.4 v7.8,3.4 v8.8,3.4 | v8.8,3.4 v9.8,3.4 v9.8,2.4 v8.8,2.4 v7.8,2.4 v6.7,2.4 v5.6,2.4
  Bottom 0.152: v43.12,5.91 v43.11,5.9 39.53,5.9 38.53,4.9 14.04,4.9 v13.94,5
  other vias: 60.8,9 60.8,10 60.8,11 59.5,9 59.5,10 59.5,11
  pour Top (no thermals): 21.6,4.4 1.9,4.4 1.9,1.8 2.1,1.6 21.6,1.6
  pour Route15: -11.9,26.9 134.9,26.9 134.9,-6.2 -11.9,-6.2
  pour Top: 56.9,14.6 71,14.6 71,7.7 56.9,7.7
VCC
  Top 0.152: U1.28 45.48,11.38 45.76,11.66 R16.2 46.29,12.6 C17.1